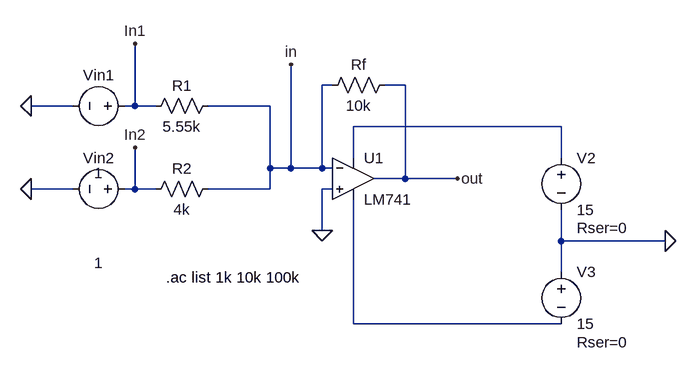
[diagram p0: schematic LM741summingAmplifier.asc]
LM741summingAmplifier.asc, the LTspice schematic file:
Version 4
SHEET 1 880 680
WIRE 160 0 144 0
WIRE 272 0 240 0
WIRE -240 32 -304 32
WIRE -144 32 -144 -64
WIRE -144 32 -160 32
WIRE -112 32 -144 32
WIRE 64 32 -32 32
WIRE 512 64 192 64
WIRE 192 112 192 64
WIRE 512 112 512 64
WIRE 64 128 64 32
WIRE 96 128 96 -32
WIRE 96 128 64 128
WIRE 144 128 144 0
WIRE 144 128 96 128
WIRE 160 128 144 128
WIRE 272 144 272 0
WIRE 272 144 224 144
WIRE 352 144 272 144
WIRE -240 160 -304 160
WIRE -144 160 -144 96
WIRE -144 160 -160 160
WIRE -112 160 -144 160
WIRE 64 160 64 128
WIRE 64 160 -32 160
WIRE 160 160 144 160
WIRE 144 224 144 160
WIRE 512 240 512 192
WIRE 672 240 512 240
WIRE 512 288 512 240
WIRE 192 368 192 176
WIRE 512 368 192 368
FLAG 96 -32 in
FLAG 352 144 out
FLAG 672 240 0
FLAG 144 224 0
FLAG -304 32 0
FLAG -304 160 0
FLAG -144 -64 In1
FLAG -144 96 In2
SYMBOL LM741 192 80 R0
SYMATTR InstName U1
SYMBOL voltage 512 96 R0
WINDOW 123 0 0 Left 0
WINDOW 39 24 124 Left 2
SYMATTR SpiceLine Rser=0
SYMATTR InstName V2
SYMATTR Value 15
SYMBOL res 256 -16 R90
WINDOW 0 0 56 VBottom 2
WINDOW 3 32 56 VTop 2
SYMATTR InstName Rf
SYMATTR Value 10k
SYMBOL voltage 512 272 R0
WINDOW 123 0 0 Left 0
WINDOW 39 24 124 Left 2
SYMATTR SpiceLine Rser=0
SYMATTR InstName V3
SYMATTR Value 15
SYMBOL res -16 16 R90
WINDOW 0 0 56 VBottom 2
WINDOW 3 32 56 VTop 2
SYMATTR InstName R1
SYMATTR Value 5.55k
SYMBOL res -16 144 R90
WINDOW 0 0 56 VBottom 2
WINDOW 3 32 56 VTop 2
SYMATTR InstName R2
SYMATTR Value 4k
SYMBOL voltage -144 32 R90
WINDOW 0 -32 56 VBottom 2
WINDOW 3 88 56 VTop 2
WINDOW 123 60 56 VTop 2
WINDOW 39 0 0 Left 0
SYMATTR InstName Vin1
SYMATTR Value 1
SYMBOL voltage -144 160 R90
WINDOW 0 -32 56 VBottom 2
WINDOW 3 98 56 VTop 2
WINDOW 123 70 56 VTop 2
WINDOW 39 0 0 Left 0
SYMATTR InstName Vin2
SYMATTR Value 1
TEXT -96 296 Left 2 !.ac list 1k 10k 100k

The netlist it stands for:
* LM741summingAmplifier.asc
XU1 0 in N001 N002 out LM741  ; pins In+ In- V+ V- OUT
V2 N001 0 15 Rser=0
Rf out in 10k
V3 0 N002 15 Rser=0
R1 in In1 5.55k
R2 in In2 4k
Vin1 In1 0 1
Vin2 In2 0 1
.ac list 1k 10k 100k
.lib LM741.lib
.backanno
.end